# Altium schematic sheet Project_hierarchy.SchDoc
size A3; CompanyName: FEDEVEL; Organization: FEDEVEL; DocumentNumber: 20; Revision: V1I1; SheetNumber: 1; SheetTotal: 4; PageSetup: Record=PageOptions|CenterHorizontal=True|CenterVertical=True|PrintScale=1.07|XCorrection=1.00|YCorrection=1.00|PrintKind=1|BorderSize=5000000|LeftOffset=0|BottomOffset=0|Orientation=2|PaperLength=1000|PaperWidth=1000|Scale=100|PaperSource=7|PrintQuality=600|MediaType=1|DitherType=10|PaperKind=A3|PrintScaleMode=1; ProjectName: KDS C6A816x Module
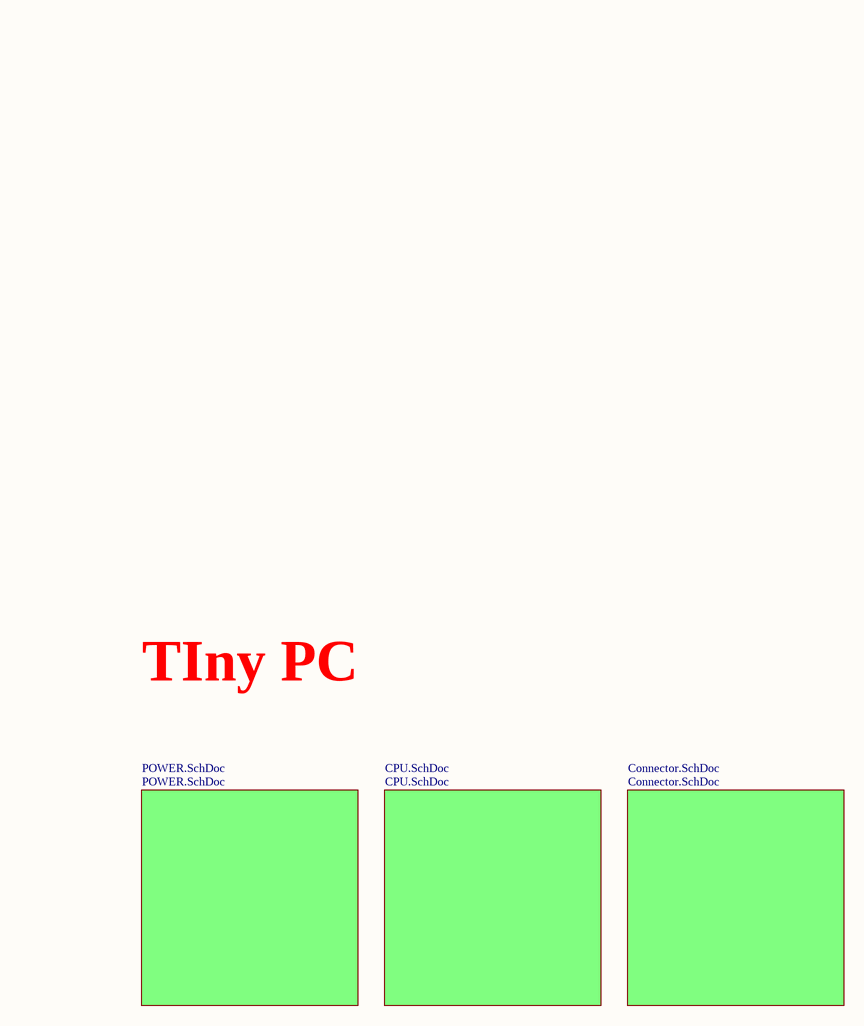
[diagram p0: Project_hierarchy.SchDoc]

## Sub-sheets
Connector.SchDoc = Connector.SchDoc: no entries
CPU.SchDoc = CPU.SchDoc: no entries
POWER.SchDoc = POWER.SchDoc: no entries

## Notes on the sheet
- TIny PC